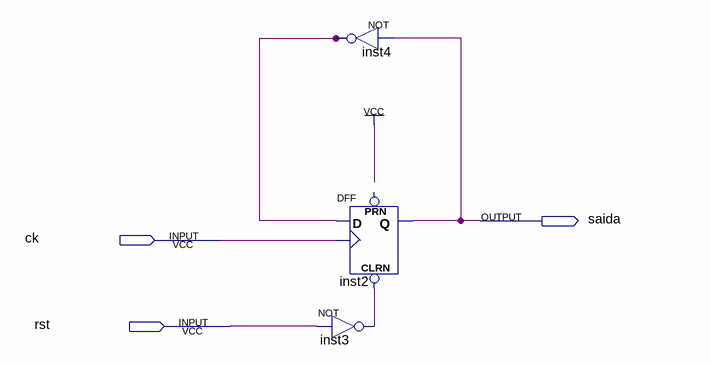
[diagram p0: schematic sheet]
// Quartus schematic Pratica05_div_freq_1_bit.bdf as structural Verilog: 3 symbols, 3 pins
module Pratica05_div_freq_1_bit (
  input  ck,
  input  rst,
  output saida
);

  wire inst3_out, inst4_out;

  not inst4 (inst4_out, saida);
  DFF inst2 (.CLRN(inst3_out), .CLK(ck), .D(inst4_out), .Q(saida));  // open: PRN
  not inst3 (inst3_out, rst);
endmodule
